# EAGLE design ETAG_v10.3_NOSDTRANS (EAGLE 9.6.2)

## Sheet 1 of 2
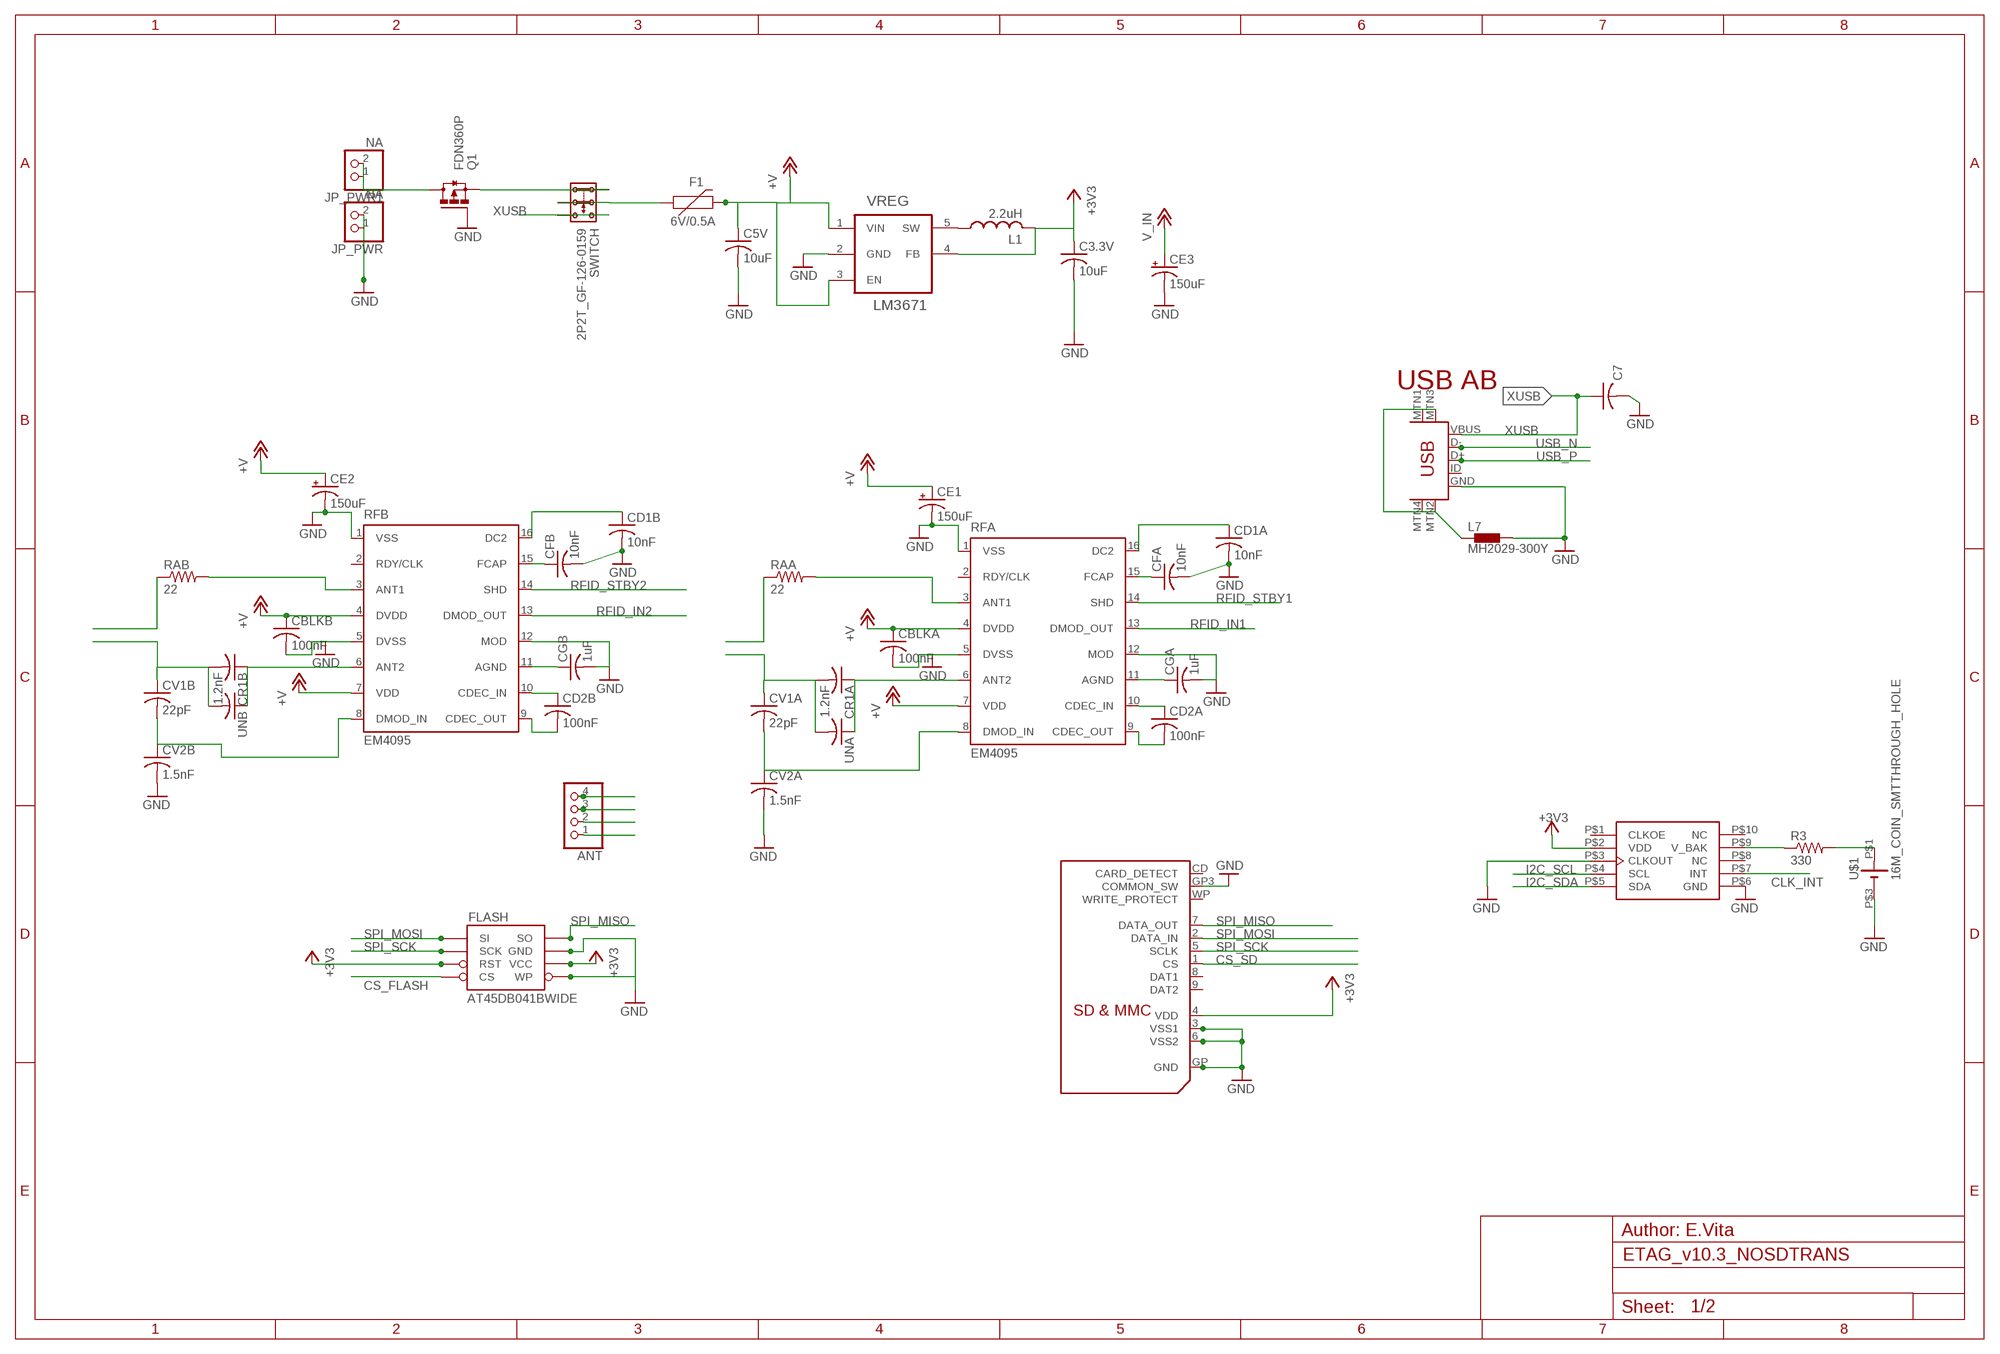
[diagram p0: schematic, sheet 1]

### Parts
ANT  PINHD-1X4  [1X04]
C3.3V  10uF  C-USC0805  [C0805]
C5V  10uF  C-USC0805  [C0805]
C7  10nF  C-USROUND  [C0603-ROUND]
CBLKA  100nF  C-US  [C0603-ROUND]
CBLKB  100nF  C-US  [C0603-ROUND]
CD1A  10nF  C-US  [C0603-ROUND]
CD1B  10nF  C-USROUND  [C0603-ROUND]
CD2A  100nF  C-US  [C0603-ROUND]
CD2B  100nF  C-US  [C0603-ROUND]
CE1  150uF  CPOL-USC  [PANASONIC_C]
CE2  150uF  CPOL-USC  [PANASONIC_C]
CE3  150uF  CPOL-USC  [PANASONIC_C]
CFA  10nF  C-USROUND  [C0603-ROUND]
CFB  10nF  C-US  [C0603-ROUND]
CGA  1uF  C-US  [C0603-ROUND]
CGB  1uF  C-US  [C0603-ROUND]
CR1A  1.2nF  C-USROUND  [C0603-ROUND]
CR1B  1.2nF  C-US  [C0603-ROUND]
CV1A  22pF  C-US  [C0603-ROUND]
CV1B  22pF  C-US  [C0603-ROUND]
CV2A  1.5nF  C-USROUND  [C0603-ROUND]
CV2B  1.5nF  C-US  [C0603-ROUND]
F1  6V/0.5A  PPTC_6V500MA-2  [1206]
FLASH  AT45DB041BWIDE  [SO08WIDE]
JP_PWR  NA  PINHD-1X2  [1X02]
JP_PWR1  NA  PINHD-1X2  [1X02]
L1  2.2uH  L-US4X4  [SMT_COIL_INDUCTOR_4X4MM]
L7  MH2029-300Y  BLM15H0805  [C0805K]
Q1  FDN360P  [SUPER-SOT3]
R3  330  R-US_ROUND  [C0603-ROUND]
RAA  22  R-US_R0805  [R0805]
RAB  22  R-US_R0805  [R0805]
RFA  EM4095  [SO16]
RFB  EM4095  [SO16]
RTC  MC-RTC-RV-3029-C3-I2C  [MC-RTC-C3_SPECIAL]
SD  SDMMC06132  [06132]
SWITCH  2P2T_GF-126-0159  [2P2T_GF-126-0159]
U$1  16M_COIN_SMTTHROUGH_HOLE  [16_MM_THROUGH_HOLE]
UNA  C-US  [C0603-ROUND]
UNB  C-US  [C0603-ROUND]
USB  USB-MINIB-5PIN  [USB-MINIB]
VREG  LM3671  LM3671_SWITCHING_REGSOT23  [SOT23-5L]

### Nets
2GND [gnd]: L7.1 USB.MTN1(MTN2) USB.MTN2(MTN3) USB.MTN3(MTN1) USB.MTN4
12_IN: JP_PWR1.1 JP_PWR1.2 Q1.3(D)
+3V3: C3.3V.1 FLASH.3(RST) FLASH.6(VCC) L1.P$2 RTC.P$2(VDD) SD.4(VDD) VREG.4(FB) ; also sheet 2
AANT: ANT.4 RAA.1
BANT: ANT.2 RAB.1
CLK_INT: RTC.P$7(INT) ; also sheet 2
CS_FLASH: FLASH.4(CS) ; also sheet 2
CS_SD: SD.1(CS) ; also sheet 2
CVA: ANT.3 CR1A.2 CV1A.1 UNA.2
CVB: ANT.1 CR1B.2 CV1B.1 UNB.2
GND [gnd]: C3.3V.2 C5V.2 C7.2 CBLKA.2 CBLKB.2 CD1A.2 CD1B.2 CE1.- CE2.- CE3.- CFA.2 CFB.2 CGA.2 CGB.2 CV2A.2 CV2B.2 FLASH.5(WP) FLASH.7(GND) JP_PWR.1 JP_PWR.2 L7.2 Q1.1(G) RFA.1(VSS) RFA.5(DVSS) RFA.12(MOD) RFB.1(VSS) RFB.5(DVSS) RFB.12(MOD) RTC.P$3(CLKOUT) RTC.P$6(GND) SD.3(VSS1) SD.6(VSS2) SD.GP3(COMMON_SW) SD.GP(GND) U$1.P$3(-) USB.GND VREG.2(GND) ; also sheet 2
I2C_SCL: RTC.P$4(SCL) ; also sheet 2
I2C_SDA: RTC.P$5(SDA) ; also sheet 2
N$2: CFB.1 RFB.15(FCAP)
N$3: CGB.1 RFB.11(AGND)
N$4: CFA.1 RFA.15(FCAP)
N$5: CGA.1 RFA.11(AGND)
N$6: CD1A.1 RFA.16(DC2)
N$7: CR1B.1 RFB.6(ANT2) UNB.1
N$8: CV1B.2 CV2B.1 RFB.8(DMOD_IN)
N$9: CD1B.1 RFB.16(DC2)
N$10: F1.1 SWITCH.P2A(2.1) SWITCH.P2B(2.2)
N$11: CD2B.2 RFB.9(CDEC_OUT)
N$12: CR1A.1 RFA.6(ANT2) UNA.1
N$13: CV1A.2 CV2A.1 RFA.8(DMOD_IN)
N$15: CD2B.1 RFB.10(CDEC_IN)
N$16: RAB.2 RFB.3(ANT1)
N$17: Q1.2(S) SWITCH.P1A(1.1) SWITCH.P1B(1.2)
N$18: CD2A.2 RFA.9(CDEC_OUT)
N$19: CD2A.1 RFA.10(CDEC_IN)
N$20: RAA.2 RFA.3(ANT1)
N$21: R3.1 RTC.P$9(V_BAK)
N$23: R3.2 U$1.P$1(+)
RFID_IN1: RFA.13(DMOD_OUT) ; also sheet 2
RFID_IN2: RFB.13(DMOD_OUT) ; also sheet 2
RFID_STBY1: RFA.14(SHD) ; also sheet 2
RFID_STBY2: RFB.14(SHD) ; also sheet 2
SPI_MISO: FLASH.8(SO) SD.7(DATA_OUT) ; also sheet 2
SPI_MOSI: FLASH.1(SI) SD.2(DATA_IN) ; also sheet 2
SPI_SCK: FLASH.2(SCK) SD.5(SCLK) ; also sheet 2
SW: L1.P$1 VREG.5(SW)
USB_N: USB.D- ; also sheet 2
USB_P: USB.D+ ; also sheet 2
V_IN: C5V.1 CBLKA.1 CBLKB.1 CE1.+ CE2.+ CE3.+ F1.2 RFA.4(DVDD) RFA.7(VDD) RFB.4(DVDD) RFB.7(VDD) VREG.1(VIN) VREG.3(EN) ; supply symbol labelled +V ; also sheet 2
XUSB [usbvcc]: C7.1 SWITCH.P3A(3.1) SWITCH.P3B(3.2) USB.VBUS
Unconnected: RFA.2(RDY/CLK) RFB.2(RDY/CLK) RTC.P$1(CLKOE) RTC.P$8(NC) RTC.P$10(NC) SD.8(DAT1) SD.9(DAT2) SD.CD(CARD_DETECT) SD.WP(WRITE_PROTECT) USB.ID

### Notes on the sheet
- USB AB
- Author: E.Vita

## Sheet 2 of 2
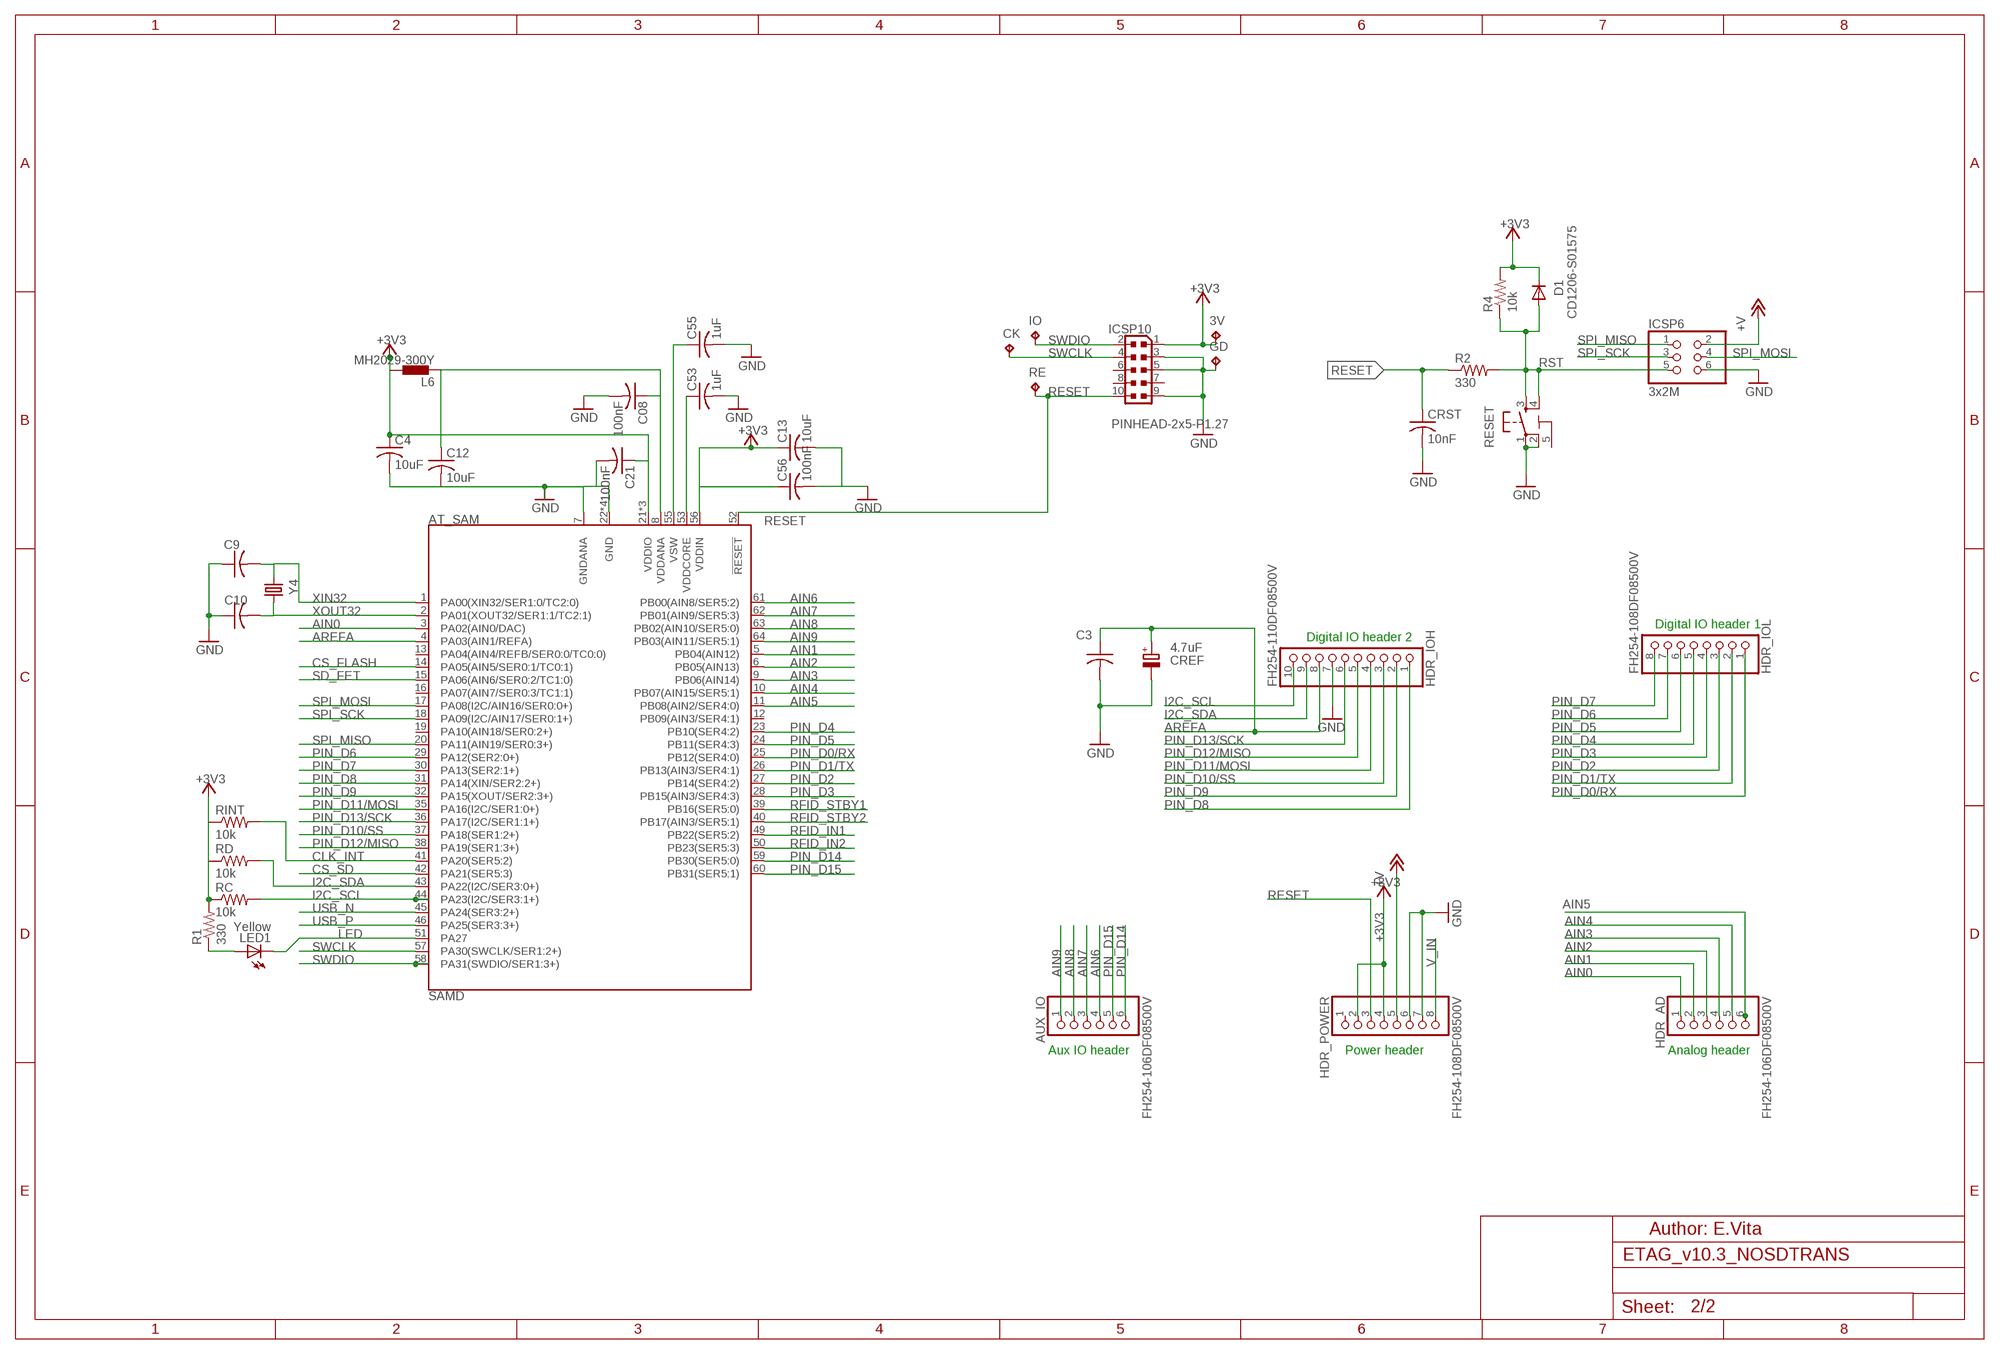
[diagram p1: schematic, sheet 2]

### Parts
3V  TPTP12R  [TP12R]
AT_SAM  SAMD  ATSAML21JTQFP_10MM_0.5PITCH  [TQFP_10MM_0.5PITCH]
AUX_IO  FH254-106DF08500V  1682_20TW-535_STD  [1X06]
C3  100nF  C-USROUND  [C0603-ROUND]
C4  10uF  C-USC0805  [C0805]
C08  100nF  C-USROUND  [C0603-ROUND]
C9  22pF  C-USROUND  [C0603-ROUND]
C10  22pF  C-USROUND  [C0603-ROUND]
C12  10uF  C-USC0805  [C0805]
C13  10uF  C-USC0805  [C0805]
C21  100nF  C-USROUND  [C0603-ROUND]
C53  1uF  C-USROUND  [C0603-ROUND]
C55  1uF  C-USROUND  [C0603-ROUND]
C56  100nF  C-USROUND  [C0603-ROUND]
CK  TPTP12R  [TP12R]
CREF  4.7uF  0474_TAJA475M016RNJ  [SMC_A]
CRST  10nF  C-USROUND  [C0603-ROUND]
D1  CD1206-S01575  0012_CD1206-S01575  [MINIMELF]
GD  TPTP12R  [TP12R]
HDR_AD  FH254-106DF08500V  1682_20TW-535_STD  [1X06]
HDR_IOH  FH254-110DF08500V  1684_20TW-537  [1X10]
HDR_IOL  FH254-108DF08500V  1683_20TW-536  [1X08]
HDR_POWER  FH254-108DF08500V  1683_20TW-536  [1X08]
ICSP6  3x2M  0114_PH254-203DF118A00V  [2X03]
ICSP10  PINHEAD-2x5-P1.27  0171_PH127-205DF055G00AROUND-PADS  [PINHEAD_2X05_127]
IO  TPTP12R  [TP12R]
L6  MH2029-300Y  BLM15H0805  [C0805K]
LED1  Yellow  0044_KPT-2012YC  [CHIPLED_0805]
R1  330  R-US_ROUND  [C0603-ROUND]
R2  330  R-US_ROUND  [C0603-ROUND]
R4  10k  R-US_ROUND  [C0603-ROUND]
RC  10k  R-US_ROUND  [C0603-ROUND]
RD  10k  R-US_ROUND  [C0603-ROUND]
RE  TPTP12R  [TP12R]
RESET  TS42031-160R-TR-7260  0946_TS42031-160W-TR-7260  [TS42]
RINT  10k  R-US_ROUND  [C0603-ROUND]
Y4  32,768Khz  0213_ABS07-32.768KHZ-T  [RESONATOR_EPSON_FC_145]

### Nets
+3V3: 3V.TP AT_SAM.21(VDDIO) AT_SAM.34(VDDIO) AT_SAM.48(VDDIO) AT_SAM.56(VDDIN) C4.1 C13.1 C21.1 C56.1 D1.C HDR_POWER.2 HDR_POWER.4 ICSP10.1 L6.2 R1.2 R4.2 RC.1 RD.1 RINT.1 ; also sheet 1
AIN0: AT_SAM.3(PA02(AIN0/DAC)) HDR_AD.1
AIN1: AT_SAM.5(PB04(AIN12)) HDR_AD.2
AIN2: AT_SAM.6(PB05(AIN13)) HDR_AD.3
AIN3: AT_SAM.9(PB06(AIN14)) HDR_AD.4
AIN4: AT_SAM.10(PB07(AIN15/SER5:1)) HDR_AD.5
AIN5: AT_SAM.11(PB08(AIN2/SER4:0)) HDR_AD.6
AIN6: AT_SAM.61(PB00(AIN8/SER5:2)) AUX_IO.4
AIN7: AT_SAM.62(PB01(AIN9/SER5:3)) AUX_IO.3
AIN8: AT_SAM.63(PB02(AIN10/SER5:0)) AUX_IO.2
AIN9: AT_SAM.64(PB03(AIN11/SER5:1)) AUX_IO.1
AREFA: AT_SAM.4(PA03(AIN1/REFA)) C3.1 CREF.+ HDR_IOH.8
CLK_INT: AT_SAM.41(PA20(SER5:2)) RINT.2 ; also sheet 1
CS_FLASH: AT_SAM.14(PA05(AIN5/SER0:1/TC0:1)) ; also sheet 1
CS_SD: AT_SAM.42(PA21(SER5:3)) ; also sheet 1
GND [gnd]: AT_SAM.7(GNDANA) AT_SAM.22(GND) AT_SAM.33(GND) AT_SAM.47(GND) AT_SAM.54(GND) C3.2 C4.2 C08.2 C9.1 C10.1 C12.2 C13.2 C21.2 C53.2 C55.2 C56.2 CREF.- CRST.2 GD.TP HDR_IOH.7 HDR_POWER.6 HDR_POWER.7 ICSP6.6 ICSP10.3 ICSP10.5 ICSP10.9 RESET.1 RESET.2 ; also sheet 1
I2C_SCL: AT_SAM.44(PA23(I2C/SER3:1+)) HDR_IOH.10 RC.2 ; also sheet 1
I2C_SDA: AT_SAM.43(PA22(I2C/SER3:0+)) HDR_IOH.9 RD.2 ; also sheet 1
LED: AT_SAM.51(PA27) LED1.C
N$1: LED1.A R1.1
N$24: AT_SAM.53(VDDCORE) C53.1
N$25: AT_SAM.55(VSW) C55.1
PIN_D0/RX: AT_SAM.25(PB12(SER4:0)) HDR_IOL.1
PIN_D1/TX: AT_SAM.26(PB13(AIN3/SER4:1)) HDR_IOL.2
PIN_D2: AT_SAM.27(PB14(SER4:2)) HDR_IOL.3
PIN_D3: AT_SAM.28(PB15(AIN3/SER4:3)) HDR_IOL.4
PIN_D4: AT_SAM.23(PB10(SER4:2)) HDR_IOL.5
PIN_D5: AT_SAM.24(PB11(SER4:3)) HDR_IOL.6
PIN_D6: AT_SAM.29(PA12(SER2:0+)) HDR_IOL.7
PIN_D7: AT_SAM.30(PA13(SER2:1+)) HDR_IOL.8
PIN_D8: AT_SAM.31(PA14(XIN/SER2:2+)) HDR_IOH.1
PIN_D9: AT_SAM.32(PA15(XOUT/SER2:3+)) HDR_IOH.2
PIN_D10/SS: AT_SAM.37(PA18(SER1:2+)) HDR_IOH.3
PIN_D11/MOSI: AT_SAM.35(PA16(I2C/SER1:0+)) HDR_IOH.4
PIN_D12/MISO: AT_SAM.38(PA19(SER1:3+)) HDR_IOH.5
PIN_D13/SCK: AT_SAM.36(PA17(I2C/SER1:1+)) HDR_IOH.6
PIN_D14: AT_SAM.59(PB30(SER5:0)) AUX_IO.6
PIN_D15: AT_SAM.60(PB31(SER5:1)) AUX_IO.5
RESET: AT_SAM.52(!RESET!) CRST.1 HDR_POWER.3 ICSP10.10 R2.1 RE.TP
RFID_IN1: AT_SAM.49(PB22(SER5:2)) ; also sheet 1
RFID_IN2: AT_SAM.50(PB23(SER5:3)) ; also sheet 1
RFID_STBY1: AT_SAM.39(PB16(SER5:0)) ; also sheet 1
RFID_STBY2: AT_SAM.40(PB17(AIN3/SER5:1)) ; also sheet 1
RST: D1.A ICSP6.5 R2.2 R4.1 RESET.3 RESET.4
SD_FET: AT_SAM.15(PA06(AIN6/SER0:2/TC1:0))
SPI_MISO: AT_SAM.20(PA11(AIN19/SER0:3+)) ICSP6.1 ; also sheet 1
SPI_MOSI: AT_SAM.17(PA08(I2C/AIN16/SER0:0+)) ICSP6.4 ; also sheet 1
SPI_SCK: AT_SAM.18(PA09(I2C/AIN17/SER0:1+)) ICSP6.3 ; also sheet 1
SWCLK: AT_SAM.57(PA30(SWCLK/SER1:2+)) CK.TP ICSP10.4
SWDIO: AT_SAM.58(PA31(SWDIO/SER1:3+)) ICSP10.2 IO.TP
USB_N: AT_SAM.45(PA24(SER3:2+)) ; also sheet 1
USB_P: AT_SAM.46(PA25(SER3:3+)) ; also sheet 1
V_IN: HDR_POWER.5 HDR_POWER.8 ICSP6.2 ; supply symbol labelled +V ; also sheet 1
VDDANA: AT_SAM.8(VDDANA) C08.1 C12.1 L6.1
XIN32: AT_SAM.1(PA00(XIN32/SER1:0/TC2:0)) C9.2 Y4.P$1
XOUT32: AT_SAM.2(PA01(XOUT32/SER1:1/TC2:1)) C10.2 Y4.P$2
Unconnected: AT_SAM.12(PB09(AIN3/SER4:1)) AT_SAM.13(PA04(AIN4/REFB/SER0:0/TC0:0)) AT_SAM.16(PA07(AIN7/SER0:3/TC1:1)) AT_SAM.19(PA10(AIN18/SER0:2+)) HDR_POWER.1 ICSP10.6 ICSP10.7 ICSP10.8

### Notes on the sheet
- Digital IO header 1
- Digital IO header 2
- Aux IO header | Power header | Analog header
- Author: E.Vita

## Power pins joined to a net without a drawn wire
5-GND: RESET.5(5-GND)

## Library data of the parts
3V CK GD IO RE = testpad:TP: Test pad
ANT = pinhead:PINHD-1X4: PIN HEADER
AT_SAM = greg-MCU:ATSAML21J: Atmel SAML21J ARM Cortex-M0+ Microcontroller The Atmel ® | SMART ™ SAM L21 is a series of low-power microcontrollers using the 32-bit ARM ® Cortex ® -M0+ processor, and ranging from 32- to 64-pins with up to 256KB Flash and 32KB of SRAM. The SAM L21 devices operate at a maximum frequency of 48MHz and reach 2.46 CoreMark/MHz. They are designed for simple and intuitive migration with identical peripheral modules, hex compatible code, identical linear address map and pin compatible migration paths between all devices in the product series. All devices include intelligent and flexible peripherals, Atmel Event System for inter-peripheral signaling, and support for capacitive touch button, slider and wheel user interfaces.
AUX_IO HDR_AD = Connettori:1682_20TW-535: Female Gray Connector strip for Arduino 3V3 bases - 6x1 F V h 8,5 p2,54; MONTHLY_USAGE: 86722.85; PART_NUMBER: 20TW-535; PRICE: _0.03; SUPPLIER: CBC_elettronica__s.r.l.; TYPE: Connettori
C3 C3.3V C4 C5V C7 C08 C9 C10 C12 C13 C21 C53 C55 C56 CBLKA CBLKB CD1A CD1B CD2A CD2B CFA CFB CGA CGB CR1A CR1B CRST CV1A CV1B CV2A CV2B UNA UNB = rcl:C-US: CAPACITOR, American symbol
CE1-CE3 = rcl:CPOL-US: POLARIZED CAPACITOR, American symbol
CREF = Condensatori:0474_TAJA475M016RNJ: 4u7 tantalio Case A - testa gialla -Tantalio; CASE: CaseA_(1206); MONTHLY_USAGE: _____; PART_NUMBER: TAJA475M016RNJ; PRICE: _____; SUPPLIER: _____; TYPE: Condensatori; VALUE: 4u7
D1 = Diodi:0012_CD1206-S01575: small-signal high-speed Switching Diodes CD1206; CASE: 1206; MONTHLY_USAGE: _____; PART_NUMBER: CD1206-S01575; PRICE: _____; SUPPLIER: _____; TYPE: Diodi
F1 = SparkFun-Fuses:PPTC: Resettable Fuse PPTC Resettable Fuse. Really a sort of resistor with a polymeric positive temperature coefficient whose resistance increases dramatically with an increase in temperature. When heated by the power passing through the resistance rises causing the current to be limited, protecting the circuit. This is achieved by the transition of the polymer from a crystalline to an amorphous state where the conductive carbon separates breaking the conductive pathways found in the cool crystalline structure. When a PPTC cools back down it resumes conducting letting the circuit turn back on. SparkFun Products: SparkFun RedBoard - Programmed with Arduino <https://www.sparkfun.com/products/12757> Pro Micro - 5V/16MHz <https://www.sparkfun.com/products/12640> Arduino Pro 328 - 5V/16MHz <https://www.sparkfun.com/products/10915> MP3 Trigger <https://www.sparkfun.com/products/13720>; PROD_ID: RES-08585
FLASH = SparkFun-DigitalIC:AT45DB041B: 4-Mbit SPI flash memory
HDR_IOH = Connettori:1684_20TW-537: Female Gray Connector strip for Arduino 3V3 bases - 10x1 F V h 8,5 p2,54mm; MONTHLY_USAGE: _____; PART_NUMBER: 20TW-537; PRICE: _____; SUPPLIER: _____; TYPE: Connettori
HDR_IOL HDR_POWER = Connettori:1683_20TW-536: Female Gray Connector strip for Arduino 3V3 bases - 8x1 F V h 8,5 p2,54mm; MONTHLY_USAGE: _____; PART_NUMBER: 20TW-536; PRICE: _____; SUPPLIER: _____; TYPE: Connettori
ICSP6 = Connettori:0114_PH254-203DF118A00V: 3x2 M V h 8,5 mm p2,54; MONTHLY_USAGE: _____; PART_NUMBER: PH254-203DF118A00V; PRICE: _____; SUPPLIER: _____; TYPE: Connettori; VALUE: ICSP
ICSP10 = Connettori:0171_PH127-205DF055G00A: 2x5 PASSO 1,27
JP_PWR JP_PWR1 = pinhead:PINHD-1X2: PIN HEADER
L1 = rcl:L-US: INDUCTOR, American symbol
L6 L7 = inductors:BLM15H: EMIFIL (R) Chip Ferrite Bead for GHz Noise Source: http://www.murata.com/ Ferrite Bead BLM15H.pdf
LED1 = Opto:0044_KPT-2012YC: LED YELLOW - SMD - 0805; MONTHLY_USAGE: _____; PART_NUMBER: KPT-2012YC; PRICE: _____; SUPPLIER: _____; TYPE: Opto
Q1 = transistor-power:FDN360P: Single P-Channel, PowerTrench (R) MOSFET Source: http://www.fairchildsemi.com/ds/FD/FDN360P.pdf
R1-R4 RAA RAB RC RD RINT = rcl:R-US_: RESISTOR, American symbol
RESET = Switches:0946_TS42031-160W-TR-7260: Pushbutton 6x6 Smd - White; MONTHLY_USAGE: _____; PART_NUMBER: IT-1157AHNP-160G-G_GTR; PRICE: _____; SUPPLIER: _____; TYPE: Switches; VALUE: TS42
RFA RFB = em-microelectronic:EM4095: Read/Write analog front end for 125kHz RFID Basestation Source: http://www.emmicroelectronic.com/webfiles/Product/RFID/DS/EM4095_DS.pdf
RTC = Microcrystal-RTC:MC-RTC-RV-3029-C3-I2C: Microcrystal RV-3029-C3 Real Time Clock Module with I2C-Bus Extremely Accurate RTC Module with embedded Xtal. I2C Interface Temperature Compensation Automotive qualified, according to AEC-Q200 Rev. C Option A: Calibrated Temperature Time Deviation @ +25°C ± 0.26 s/day ± 3ppm 0°C to +50°C ± 0.35 s/day ± 4ppm -10°C to +60°C ± 0.44 s/day ± 5ppm -40°C to +85°C ± 0.52 s/day ± 6ppm -40°C to +125°C ± 0.70 s/day ± 8ppm Option B: Default Temperature Time Deviation @ +25°C ± 0.26 s/day ± 3ppm 0°C to +50°C ± 0.44 s/day ± 5ppm -10°C to +60°C ± 0.87 s/day ±10ppm -40°C to +85°C ± 2.17 s/day ±25ppm -40°C to +125°C ± 2.60 s/day ±30ppm
SD = microbuilder:SDMMC: SD MMC Card holder 4UCON part #06132 - easy to solder
SWITCH = switch:2P2T_GF-126-0159
U$1 = battery:16M_COIN_SMT
USB = USB_miniB:USB-MINIB
VREG = Texas Instruments:LM3671_SWITCHING_REG
Y4 = Cristalli:0213_ABS07-32.768KHZ-T: 32,768KHz - SMD; MONTHLY_USAGE: _____; PART_NUMBER: ABS07-32.768KHZ-T; PRICE: _____; SUPPLIER: _____; TYPE: Cristalli; VALUE: 32,768Khz_SMD

## Net classes
1 USB: width 0.203 mm, drill 0.305 mm, clearance 0.178 mm
2 gnd: width 0.254 mm, drill 0.254 mm, clearance 0.178 mm
3 usbvcc: width 0.203 mm, drill 0.406 mm, clearance 0.178 mm
4 USBpair: width 0.254 mm, drill 0.406 mm, clearance 0.406 mm

## Board
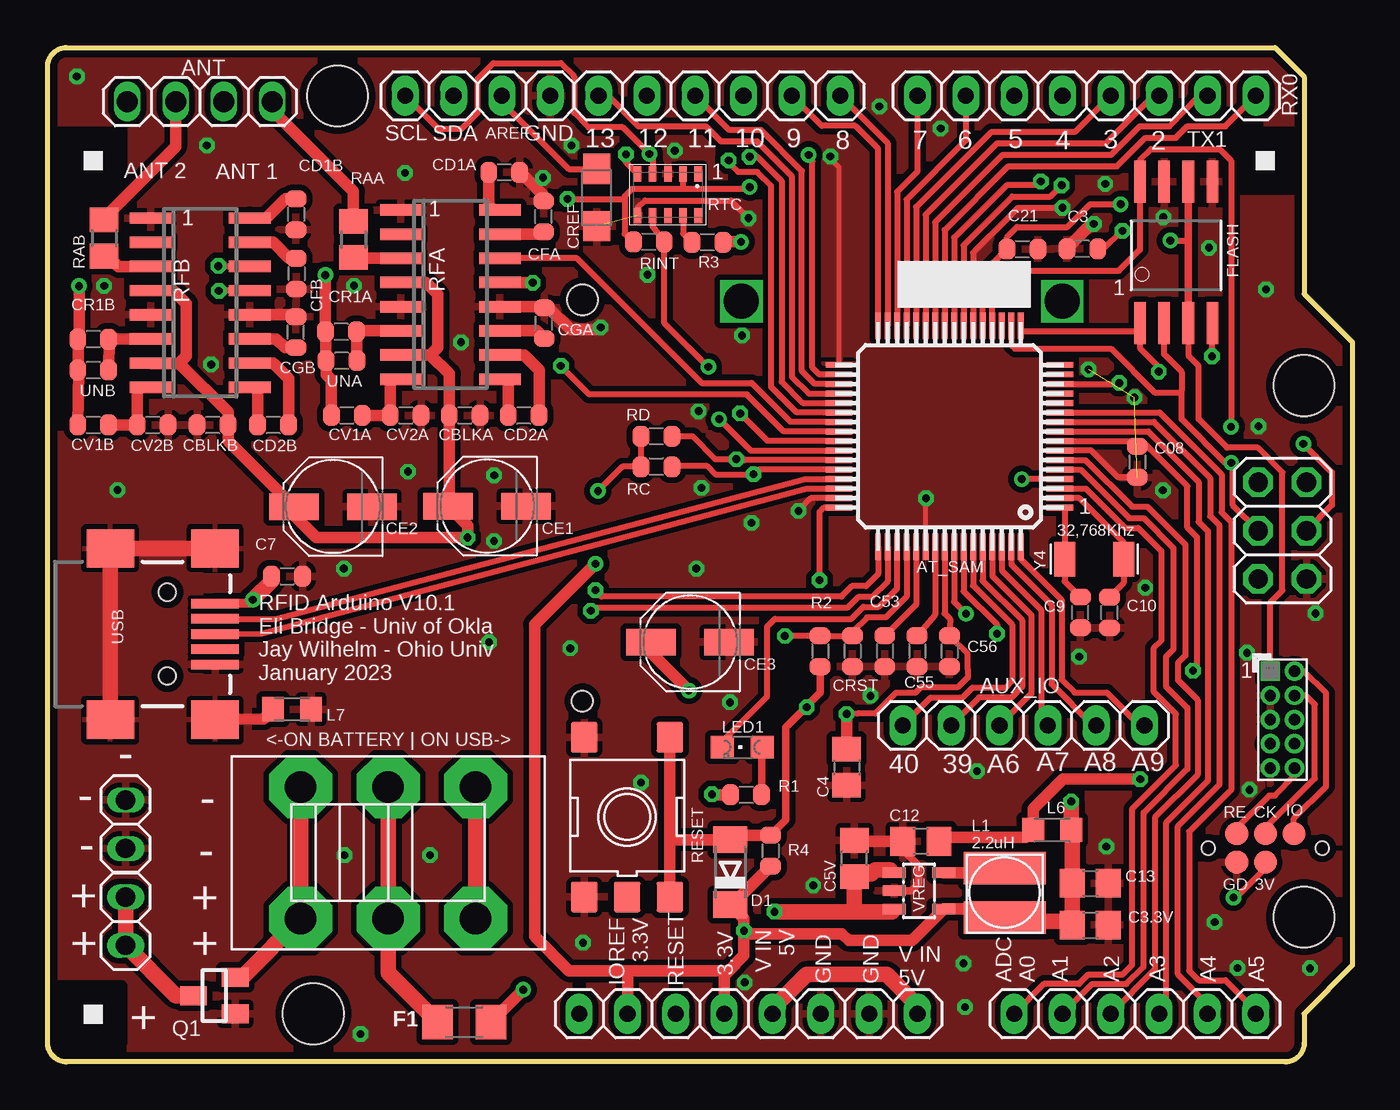
[diagram p2: board, top side]
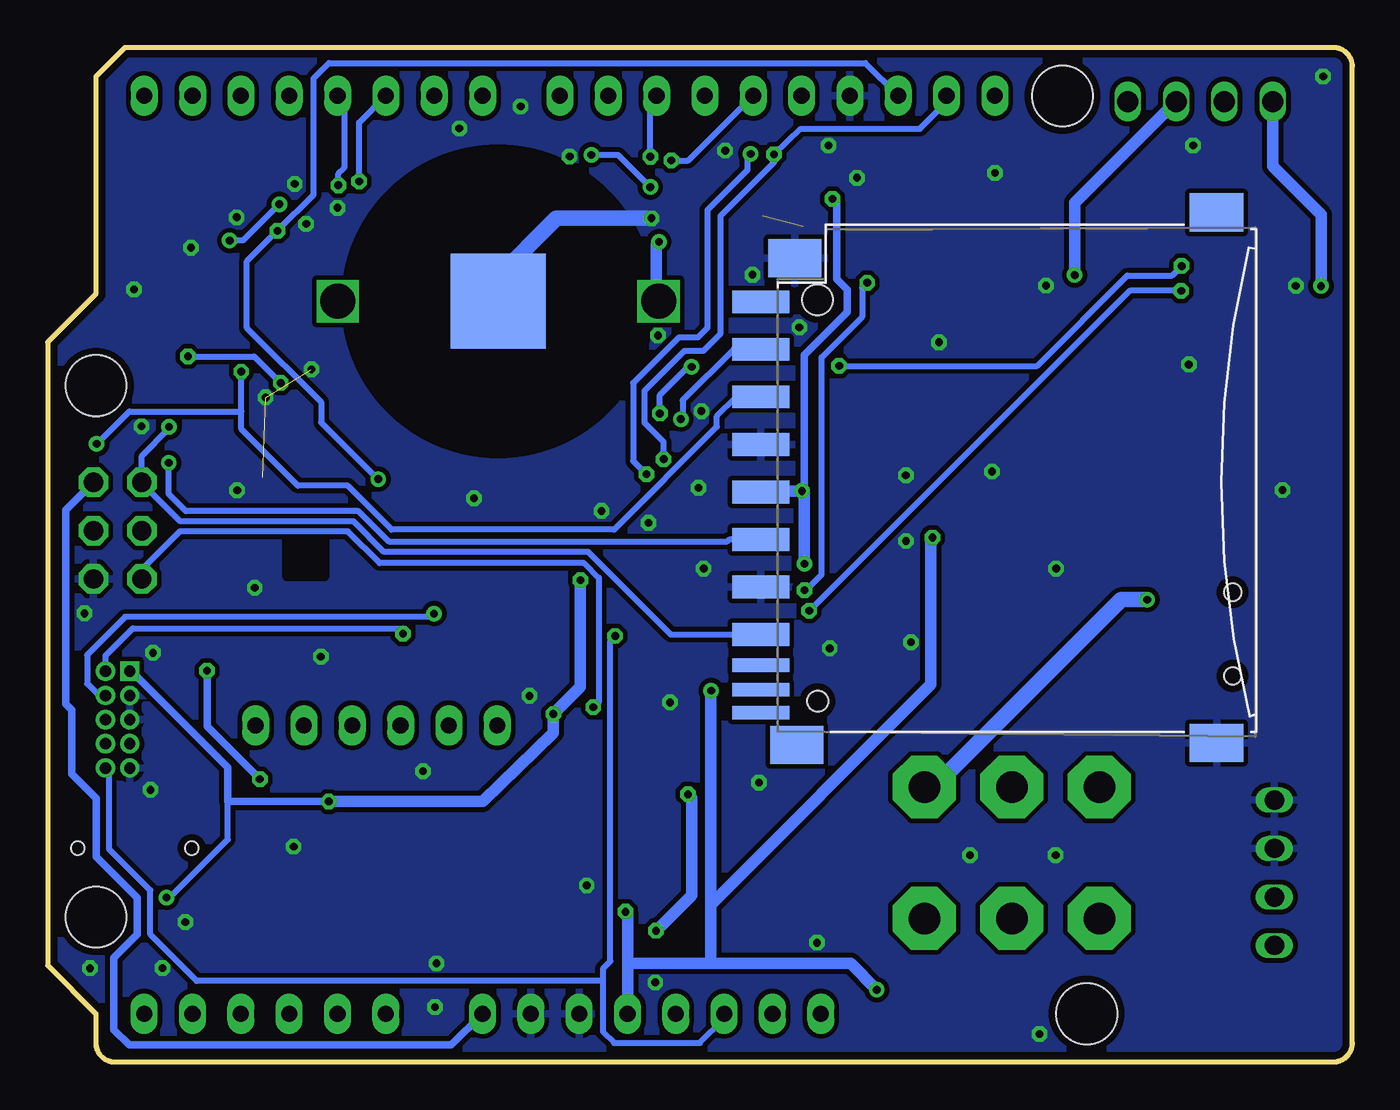
[diagram p3: board, bottom side, seen from below]

Size 68.58 x 53.34 mm. Coordinates in mm from the lower left corner, seen from the top.
Outline: 64.52,53.34 66.04,51.82 66.04,40.39 68.58,37.85 68.58,5.08 66.04,2.54 66.04,1 arc-90 65.04,0 1,0 arc-90 0,1 0,52.34 arc-90 1,53.34 64.52,53.34
Copper layers (1*2+15*16): Top 0.035mm / dielectric 0.5mm / layer 2 0.035mm / dielectric 0.4mm / layer 15 0.035mm / dielectric 0.5mm / Bottom 0.035mm
Design rules "ArduinoUno *": minimum track width 6mil, minimum drill 16mil, track to track 6mil, track to pad 6mil, pad to pad 4mil, via to via 6mil, smd to smd 4mil, copper to edge 15mil, drill to drill 10mil, minimum pad ring 6mil, minimum via ring 4.5mil, stop-mask expansion 1mil, vias tented up to drill 32mil, thermal gap 10mil
Holes 3.2 mm at 66.04,35.56 66.04,7.62 15.24,50.8 13.97,2.54
Holes 0.7 mm at 61,11.25 67,11.25
bRestrict: area 36.9,32 to 52.9,48

### Footprints (pad centres in the part's own frame; a part is rotated, then mirrored left to right if it is on the bottom)
TP12R = smd 1.2 x 1.2: TP 0,0
1X04 = drill 1.1 long: 1 -3.81,0; 2 -1.27,0; 3 1.27,0; 4 3.81,0
TQFP_10MM_0.5PITCH = smd 1.4 x 0.3: 1 -5.8,3.75; 2 -5.8,3.25; 3 -5.8,2.75; 4 -5.8,2.25; 5 -5.8,1.75; 6 -5.8,1.25; 7 -5.8,0.75; 8 -5.8,0.25; 9 -5.8,-0.25; 10 -5.8,-0.75; 11 -5.8,-1.25; 12 -5.8,-1.75; 13 -5.8,-2.25; 14 -5.8,-2.75; 15 -5.8,-3.25; 16 -5.8,-3.75; 33 5.8,-3.75; 34 5.8,-3.25; 35 5.8,-2.75; 36 5.8,-2.25; 37 5.8,-1.75; 38 5.8,-1.25; 39 5.8,-0.75; 40 5.8,-0.25; 41 5.8,0.25; 42 5.8,0.75; 43 5.8,1.25; 44 5.8,1.75; 45 5.8,2.25; 46 5.8,2.75; 47 5.8,3.25; 48 5.8,3.75 | smd 0.3 x 1.4: 17 -3.75,-5.8; 18 -3.25,-5.8; 19 -2.75,-5.8; 20 -2.25,-5.8; 21 -1.75,-5.8; 22 -1.25,-5.8; 23 -0.75,-5.8; 24 -0.25,-5.8; 25 0.25,-5.8; 26 0.75,-5.8; 27 1.25,-5.8; 28 1.75,-5.8; 29 2.25,-5.8; 30 2.75,-5.8; 31 3.25,-5.8; 32 3.75,-5.8; 49 3.75,5.8; 50 3.25,5.8; 51 2.75,5.8; 52 2.25,5.8; 53 1.75,5.8; 54 1.25,5.8; 55 0.75,5.8; 56 0.25,5.8; 57 -0.25,5.8; 58 -0.75,5.8; 59 -1.25,5.8; 60 -1.75,5.8; 61 -2.25,5.8; 62 -2.75,5.8; 63 -3.25,5.8; 64 -3.75,5.8
1X06 = drill 0.85 pad 1.422 long: 1 -6.35,0; 2 -3.81,0; 3 -1.27,0; 4 1.27,0; 5 3.81,0; 6 6.35,0
C0603-ROUND = smd 0.898 x 1.1: 1 -0.813,0; 2 0.813,0
C0805 = smd 1.3 x 1.5: 1 -0.95,0; 2 0.95,0
PANASONIC_C = smd 2.6 x 1.4: + 2.05,0; - -2.05,0
SMC_A = smd 1.6 x 1.4: + -1.5,0; - 1.5,0
MINIMELF = smd 1.4 x 1.8: A 1.7,0; C -1.7,0
1206 = smd 1.6 x 1.8: 1 -1.4,0; 2 1.4,0
SO08WIDE = smd 0.61 x 2.21: 1 -1.905,-3.569; 2 -0.635,-3.569; 3 0.635,-3.569; 4 1.905,-3.569; 5 1.905,3.886; 6 0.635,3.886; 7 -0.635,3.886; 8 -1.905,3.886
1X10 = drill 0.85 pad 1.422 long: 1 -11.43,0; 2 -8.89,0; 3 -6.35,0; 4 -3.81,0; 5 -1.27,0; 6 1.27,0; 7 3.81,0; 8 6.35,0; 9 8.89,0; 10 11.43,0
1X08 = drill 0.85 pad 1.422 long: 1 -8.89,0; 2 -6.35,0; 3 -3.81,0; 4 -1.27,0; 5 1.27,0; 6 3.81,0; 7 6.35,0; 8 8.89,0
2X03 = drill 1.016 pad 1.55 octagon: 1 -2.54,-1.27; 2 -2.54,1.27; 3 0,-1.27; 4 0,1.27; 5 2.54,-1.27; 6 2.54,1.27
PINHEAD_2X05_127 = drill 0.6 pad 1.016 square: 1 -0.635,2.54 | drill 0.6 pad 1.016: 2 0.635,2.54; 3 -0.635,1.27; 4 0.635,1.27; 5 -0.635,0; 6 0.635,0; 7 -0.635,-1.27; 8 0.635,-1.27; 9 -0.635,-2.54; 10 0.635,-2.54
1X02 = drill 1.016 long: 1 -1.27,0; 2 1.27,0
SMT_COIL_INDUCTOR_4X4MM = smd 1.7 x 4.3: P$1 -1.3,0; P$2 1.3,0
C0805K = smd 1.143 x 1.27: 1 -1,0; 2 1,0
CHIPLED_0805 = smd 1.2 x 1.2: A 0,-1.05; C 0,1.05
SUPER-SOT3 = smd 1 x 1.4: 1 -0.95,-1.1; 2 0.95,-1.1; 3 0,1.1
R0805 = smd 1.3 x 1.5: 1 -0.95,0; 2 0.95,0
TS42 = smd 1.6 x 1.4: 1 -4.2,2.25; 2 4.2,2.25; 3 -4.2,-2.25; 4 4.2,-2.25; 5 -4.2,0
SO16 = smd 0.6 x 2.2: 1 -4.445,-2.6; 2 -3.175,-2.6; 3 -1.905,-2.6; 4 -0.635,-2.6; 5 0.635,-2.6; 6 1.905,-2.6; 7 3.175,-2.6; 8 4.445,-2.6; 9 4.445,2.6; 10 3.175,2.6; 11 1.905,2.6; 12 0.635,2.6; 13 -0.635,2.6; 14 -1.905,2.6; 15 -3.175,2.6; 16 -4.445,2.6
MC-RTC-C3_SPECIAL = smd 0.4 x 0.8: P$1 -1.6,-1.1; P$2 -0.8,-1.1; P$3 0,-1.1; P$4 0.8,-1.1; P$5 1.6,-1.1; P$6 1.6,1.1; P$7 0.8,1.1; P$8 0,1.1; P$9 -0.8,1.1; P$10 -1.6,1.1
06132 = smd 1.2 x 3: 1 6.9,0.9; 2 4.4,0.9; 3 1.9,0.9; 4 -0.6,0.9; 5 -3.1,0.9; 6 -5.6,0.9; 7 -8.1,0.9; 9 9.4,0.9 | smd 0.7 x 3: 8 -9.7,0.9; CD -11,0.9; WP -12.2,0.9 | smd 2 x 2.8: GP -13.8,-23.07; GP2 14.1,-23.07; GP3 11.7,-0.9; GP4 -13.9,-1 | hole 1.1: -11.6,-2.1 | hole 1.6: 9.5,-2.1
2P2T_GF-126-0159 = drill 1.651 pad 3.302 octagon: P1A -4.597,3.454; P1B -4.597,-3.454; P2A 0,3.454; P2B 0,-3.454; P3A 4.597,3.454; P3B 4.597,-3.454
16_MM_THROUGH_HOLE = drill 1.85 pad 2.2 square: P$1 -8.435,0; P$2 8.435,0 | smd 5 x 5: P$3 0,0
USB-MINIB = smd 2.5 x 0.5: D+ 2.5,0; D- 2.5,0.8; GND 2.5,-1.6; ID 2.5,-0.8; VBUS 2.5,1.6 | smd 2.5 x 2: MTN1 -3,4.5; MTN2 2.5,4.5; MTN3 -3,-4.5; MTN4 2.5,-4.5 | hole 0.9: 0,2.2; 0,-2.2
SOT23-5L = smd 0.55 x 1.2: 1 -0.95,-1.3; 2 0,-1.3; 3 0.95,-1.3; 4 0.95,1.3; 5 -0.95,1.3
RESONATOR_EPSON_FC_145 = smd 1.1 x 1.8: P$1 -1.55,0; P$2 1.55,0

### Placement (x,y rotation side)
3V  64,10.5 90 top
ANT  8,50.5 0 top
AT_SAM  47.4,32.9 180 top
AUX_IO  51.3,17.7 180 top
C3  54.38,42.76 180 top
C3.3V  54.8,7.2 0 top
C4  42,15.5 270 top
C5V  42.4,10.7 90 top
C7  12.59,25.54 0 top
C08  57.27,31.55 270 top
C9  54.28,23.64 90 top
C10  55.82,23.63 90 top
C12  45.9,11.6 180 top
C13  54.8,9.4 0 top
C21  51.23,42.74 0 top
C53  44,21.6 270 top
C55  45.7,21.6 270 top
C56  47.4,21.6 270 top
CBLKA  21.93,34 0 top
CBLKB  8.68,33.5 180 top
CD1A  24,46.77 0 top
CD1B  13.05,44.58 270 top
CD2A  25.02,34 180 top
CD2B  11.85,33.5 180 top
CE1  23.1,29.23 180 top
CE2  15,29.2 180 top
CE3  33.77,22.07 180 top
CFA  26.07,44.45 90 top
CFB  13.07,41.45 270 top
CGA  26.1,38.85 90 top
CGB  13.05,38.38 90 top
CK  64,12 90 top
CR1A  15.43,38.4 180 top
CR1B  2.4,38 180 top
CREF  28.86,45.45 270 top
CRST  42.3,21.6 270 top
CV1A  15.72,34 0 top
CV1B  2.4,33.5 0 top
CV2A  18.82,34 0 top
CV2B  5.53,33.5 0 top
D1  35.88,9.98 90 top
F1  21.9,2.1 0 top
FLASH  59.32,42.41 0 top
GD  62.5,10.5 90 top
HDR_AD  57.15,2.54 0 top
HDR_IOH  30.23,50.8 180 top
HDR_IOL  54.61,50.8 180 top
HDR_POWER  36.83,2.54 0 top
ICSP6  64.9,27.94 270 top
ICSP10  64.9,18 0 top
IO  65.5,12 90 top
JP_PWR  4.1,12.5 270 top
JP_PWR1  4.1,7.4 90 top
L1  50.3,8.9 270 top
L6  52.8,12.2 0 top
L7  12.85,18.55 0 top
LED1  36.51,16.55 90 top
Q1  8.76,3.49 90 top
R1  36.71,14.05 180 top
R2  40.6,21.6 270 top
R3  34.67,43.1 0 top
R4  37.99,11.11 270 top
RAA  16.07,43.25 270 top
RAB  2.98,43.33 270 top
RC  32,31.3 0 top
RD  32,32.9 0 top
RE  62.5,12 90 top
RESET  30.46,12.88 90 top
RFA  21.18,40.35 270 top
RFB  8.03,39.92 270 top
RINT  31.6,43.12 0 top
RTC  32.6,45.6 180 top
SD  30.21,30.57 90 bottom
SWITCH  17.9,11 0 top
U$1  44.9,40 180 bottom
U$2  [SQUARE-1MM-3R]  2.4,47.4 0 top
U$3  [SQUARE-1MM-3R]  64,47.4 0 top
U$4  [SQUARE-1MM-3R]  2.4,2.5 0 top
UNA  15.45,36.88 180 top
UNB  2.4,36.38 180 top
USB  6.3,22.5 0 top
VREG  45.8,9 270 top
Y4  55.01,26.44 0 top

### Tracks (layer width: path | path; a pad name or v marks a point on that pad's centre or on a via)
2GND
  Top 0.61: L7.1 11.35,18.05 USB.MTN4
  Top 0.813: USB.MTN3 USB.MTN1 USB.MTN2
  pour Top: 1.96,28.18 10.6,28.18 10.6,25.86 8.05,25.86 8.05,19.89 10.6,19.89 10.6,16.97 1.96,16.97
12_IN
  Top 0.813: JP_PWR1.2 JP_PWR1.1 6.74,3.49 Q1.3
+3V3  (via drill 0.41)
  Top 0.305: ICSP10.1 64.26,24.16 64.9,24.8 64.9,31 63.6,32.3 62,32.3 60.5,33.8 60.5,36.6 59.95,37.15 FLASH.3 | 33.4,45.9 30.7,45.9 30.32,45.52 30.32,45.38 | 33.4,45.9 RTC.P$2 | RD.1 31.19,31.68 31.2,31.69 31.19,31.68 RC.1 30.2,31.3 v28.93,30.02 | AT_SAM.21 49.15,41.47 C21.1 50.42,43.37 50.95,43.9 53.6,43.9 54.8,45.1 v56.4,45.1 | 3V.TP 64,10.18 62.48,8.65 v62.33,8.65 | v40.58,25.32 40.58,28.93 40.8,29.15 AT_SAM.48 | RINT.1 30.75,43.12 30.32,43.55 30.32,45.38 | v59.01,43.19 59.84,43.19 59.95,43.3 | AT_SAM.34 40.55,36.15 40.2,36.5 40.2,47.35 40,47.55 v40,47.7 | v36.9,46 36.8,45.9 33.4,45.9 | AT_SAM.56 47.15,23.58 47.44,23.29 C56.1 48.35,21.46 48.37,20.63 48.37,20.21 47.88,19.73 45.92,19.73 45.63,19.43 44.6,19.43 43.5,18.32 42.58,18.32 v42,18.3 | v27.32,45.38 30.32,45.38
  Top 0.406: FLASH.6 59.95,43.3 FLASH.3
  Top 0.61: R4.2 35.98,8.28 D1.C 36.6,7.56 v36.6,6.9 | 50.5,7.4 L1.P$2 49.85,8.05 VREG.4 45.45,6.4 42.1,6.4 41.75,6.75 36.75,6.75 v36.6,6.9 | v42,18.3 C4.1 | v34.92,14.07 34.88,14.05 R1.2 | v28.8,26.2 25.6,23 25.6,6.6 27.4,4.8 30.5,4.8 | 30.5,4.8 35.8,4.8 | 35.8,4.8 36.6,5.6 v36.6,6.9 | HDR_POWER.2 30.48,4.78 30.5,4.8 | HDR_POWER.4 35.56,4.56 35.8,4.8
  Top 0.813: 50.5,7.4 53.65,7.4 C3.3V.1 C13.1 53.85,12.15 L6.2 v53.8,13.7
  Bottom 0.305: v62.33,8.65 62.15,8.65 59.1,11.7 59.1,13.7 59.1,13.8 | 29.85,30 29.82,30.02 | 31.08,30 SD.4 | v56.4,45.1 58.31,43.19 v59.01,43.19 | v40,47.7 38.6,47.7 v36.9,46
  Bottom 0.406: ICSP10.1 64.16,20.54 59.1,15.48 59.1,13.8 | v53.8,13.7 59.1,13.7 | v27.32,45.38 27.1,45.15 27.1,41.17 26.55,40.62 26.55,39.42 28.8,37.17 28.8,29.6
  Bottom 0.61: v40.58,25.32 40.58,19.73 v42,18.3 42,17.3 45.7,13.7 v53.8,13.7 | v36.6,6.9 34.73,8.78 34.73,13.88 v34.92,14.07 | 29.82,30.02 v28.93,30.02 28.8,29.9 28.8,29.6 v28.8,26.2 | 31.08,30 29.85,30
AANT
  Top 0.61: ANT.4 11.81,50.05 16.07,45.78 RAA.1
AIN0
  Top 0.305: HDR_AD.1 52.36,4.1 54.2,4.1 54.7,4.6 56.5,4.6 57,5.1 57,13.3 59.3,15.6 59.3,18.3 58.15,19.45 58.15,21.77 58.55,22.18 58.55,26.85 57.31,28.09 56.64,28.09 54.58,30.15 AT_SAM.3
AIN1
  Top 0.305: HDR_AD.2 54.9,4.1 56.7,4.1 57.6,5 57.6,13.1 59.9,15.4 59.9,18.62 58.77,19.75 58.77,21.3 59.17,21.7 59.17,27.02 57.6,28.6 56.85,28.6 54.3,31.15 AT_SAM.5
AIN2
  Top 0.305: AT_SAM.6 54.54,31.65 54.55,31.65 57,29.2 57.8,29.2 59.8,27.2 59.8,21.38 59.4,20.98 59.4,20.07 60.45,19.02 60.45,15.1 58.2,12.85 58.2,4.86 HDR_AD.3
AIN3
  Top 0.305: AT_SAM.9 57.85,33.15 60.5,30.5 60.5,28.4 61,27.9 61,14.8 58.8,12.6 58.8,2.92 HDR_AD.4
AIN4
  Top 0.305: AT_SAM.10 58.15,33.65 61.1,30.7 61.1,28.7 61.6,28.2 61.6,14.6 59.4,12.4 59.4,4.6 60.96,3.04 HDR_AD.5
AIN5
  Top 0.305: AT_SAM.11 58.45,34.15 61.7,30.9 61.7,28.9 62.2,28.4 62.2,14.3 60,12.1 60,4.8 60.5,4.3 61.9,4.3 63.5,2.7 HDR_AD.6
AIN6
  Top 0.305: AT_SAM.61 49.65,25.55 51.7,23.5 51.7,19.37 AUX_IO.4
AIN7
  Top 0.305: AT_SAM.62 50.15,25.85 52.23,23.77 52.23,18.07 52.57,17.73 AUX_IO.3
AIN8
  Top 0.305: AT_SAM.63 50.65,26.15 52.77,24.02 52.77,19.87 54.94,17.7 AUX_IO.2
AIN9
  Top 0.305: AT_SAM.64 51.15,26.45 53.3,24.3 53.3,20.1 53.97,19.43 55.66,19.43 57.38,17.7 AUX_IO.1
AREFA  (via drill 0.41)
  Top 0.305: v56.5,43.7 56.43,43.63 56.4,43.66 55.49,42.76 C3.1 | AT_SAM.4 v51.2,30.65 | HDR_IOH.8 23.88,50.48 27.4,46.95 CREF.+
  Bottom 0.305: v51.2,30.65 51.23,30.65 54.2,33.62 54.2,34.7 58.1,38.6 58.1,42.1 v56.5,43.7 54.6,45.6 54.6,51.73 53.8,52.53 25.6,52.53 HDR_IOH.8
BANT
  Top 0.61: ANT.2 6.72,48.12 2.98,44.38 RAB.1
CLK_INT  (via drill 0.41)
  Top 0.305: RTC.P$7 31.8,43.93 RINT.2 32.41,38.86 v34.73,36.55 | AT_SAM.41 37.85,32.65 v36.4,34.1
  Bottom 0.305: v36.4,34.1 36.4,35.08 34.92,36.55 v34.73,36.55
CS_FLASH  (via drill 0.41)
  Top 0.305: FLASH.4 61.22,38.14 61.2,38.16 v61.2,37.1 | v56.33,35.7 56.27,35.65 AT_SAM.14
  Bottom 0.305: v61.2,37.1 57.73,37.1 v56.33,35.7
CS_SD  (via drill 0.41)
  Top 0.305: v35.3,33.8 36.95,32.15 AT_SAM.42
  Bottom 0.305: SD.1 32.53,37.47 35.2,34.8 35.2,33.9 v35.3,33.8
CVA  (via drill 0.41)
  Top 0.61: CV1A.1 14.91,35.88 14.64,36.15 UNA.2 14.61,36.9 CR1A.2 14.6,38.41 v14.6,41.38
  Bottom 0.61: v14.6,41.38 14.6,45.17 ANT.3
CVB  (via drill 0.41)
  Top 0.61: CV1B.1 1.64,36.35 UNB.2 1.64,36.4 CR1B.2 1.66,38.08 1.66,40.79 v1.65,40.8
  Bottom 0.61: v1.65,40.8 1.65,44.56 4.19,47.1 ANT.1
GND  (via drill 0.41)  (3 unrouted)
  Top 0.254: AT_SAM.33 41.6,47.02 41.61,47.02 41.14,47.49 v41.14,47.62 | AT_SAM.54 46.15,29.62 v46.17,29.65
  Top 0.305: RTC.P$6 31,44.9 31.4,45.3 35.91,45.3 v36.84,44.37 | AT_SAM.7 54.85,32.15 56.26,30.74 C08.2 | AT_SAM.47 40.12,29.65 39.47,29 v39.47,28.97 | v53.34,44.92 53.32,44.9 51,44.9 48.65,42.55 AT_SAM.22
  Top 0.406: C12.2 44.95,11.15 45.8,10.3 45.8,9.4 45.4,9 VREG.2
  Top 0.61: C5V.2 42.55,11.6 C12.2 | CGB.2 12.95,39.29 RFB.12 | CFA.2 26.07,45.56 24.96,46.67 24.93,46.66 CD1A.2 | RFA.12 26.05,39.72 CGA.2 26.32,39.66 27.49,38.5 28.95,38.5 v29.07,38.62 | C3.2 54.88,44.07 v54.99,44.07
  Bottom 0.813: U$1.P$3 44.9,41.31 41.84,44.37 v36.84,44.37
  other vias: 48.14,5.19 16.45,1.47 15.57,25.95 23.2,22.07 23.46,27.39 28.14,6.27 58.62,30.06 48.84,15.29 40.24,9.29 3.67,30.07 64.04,40.62 63.64,33.42 46.94,49.09 61.34,7.36 66.35,4.93 55.65,11.33 34.22,34.22 34.1,25.95 43.71,50.24 15.6,10.87 20.1,10.87 26.04,46.49 1.54,51.82 18.79,46.74 43.25,19.25 23.47,30.85 36.64,4.19 57.69,24.94 58.64,44.42 36.5,38.2 57.12,34.94 66.64,23.59 54.22,21.31 61.04,42.82 63.04,21.51 54.71,36.42 34.37,30.2 8.37,48.2 32.96,47.92 63.17,14.31 62.54,4.94 48.22,2.89 31.19,14.69 8.6,36.67 2.98,40.8 16.1,40.82 55.59,46.17 27.47,21.75 35.87,18.91 31.53,41.4 18.95,31.05 21.73,37.85 27.54,48.19 37,28.35
  pour Bottom (isolate 0.254, rank 2): 0.2,53.2 64.4,53.2 66,51.6 66,40.3 68.5,37.8 68.6,5 66,2.4 66,0 0.2,0
  pour Top (isolate 0.305): 0.4,53 64.5,53 65.9,51.6 65.9,40.1 68.3,37.7 68.3,5.2 65.8,2.7 65.8,0.8 65.3,0.3 0.8,0.3 0.3,0.8 0.3,52.9 0.5,52.9
I2C_SCL  (via drill 0.41)
  Top 0.305: AT_SAM.44 37.35,31.15 v37.1,30.9 35.1,30.9 34.67,31.32 32.84,31.32 RC.2 | RTC.P$4 31.8,47.58 v31.62,47.75 30.23,49.15 28.43,49.15 27.67,49.9 27.67,51.83 26.97,52.53 23.43,52.53 22.6,51.7 22.6,49.9 22.58,49.9 21.76,49.07 20.52,49.07 HDR_IOH.10 | HDR_IOH.10
  Bottom 0.305: v31.62,47.75 31.8,47.58 31.8,46.9 33.9,44.8 33.9,38.6 34.4,38.1 35.4,38.1 37.8,35.7 37.8,31.6 v37.1,30.9
I2C_SDA  (via drill 0.41)
  Top 0.305: AT_SAM.43 36.65,31.65 36.6,31.7 v36.2,31.7 35.1,31.7 33.9,32.9 RD.2 | RTC.P$5 30.4,47.3 v30.4,47.73
  Bottom 0.305: HDR_IOH.9 21.34,50.46 22.74,49.06 28.99,49.06 v30.4,47.73 30.4,47.3 33.2,44.5 33.2,38.3 34.1,37.4 35.1,37.4 37.2,35.3 37.2,33.6 36.2,32.6 v36.2,31.7
LED
  Top 0.305: 35.46,16.86 37.8,19.2 37.8,22.88 38.23,23.3 42.25,23.3 42.88,23.93 43.67,23.93 44.65,24.9 AT_SAM.51
  Top 0.406: LED1.C 35.46,16.86
N$1
  Top 0.406: LED1.A 37.53,16.51 R1.1
N$2
  Top 0.61: RFB.15 11.85,43.1 12.69,42.26 CFB.1
N$3
  Top 0.61: RFB.11 12.03,38.02 12.49,37.56 CGB.1
N$4
  Top 0.61: CFA.1 25.96,43.52 RFA.15
N$5
  Top 0.61: CGA.1 25.86,38.28 25.86,38.29 25.7,38.45 RFA.11
N$6
  Top 0.61: RFA.16 23.76,44.81 23.35,44.81 23.19,45.15 CD1A.1
N$7
  Top 0.61: RFB.6 3.26,38.02 | 3.26,38.02 3.24,38.02 UNB.1 | 3.26,38.02 CR1B.1
N$8
  Top 0.61: RFB.8 4.71,35.48 CV2B.1 CV1B.2
N$9
  Top 0.61: RFB.16 11.49,44.37 12.51,45.39 CD1B.1
N$10
  Top 0.813: SWITCH.P2A SWITCH.P2B 17.9,4.7 F1.1
N$11
  Top 0.61: CD2B.2 11.04,35.48 RFB.9
N$12
  Top 0.61: UNA.1 16.24,36.9 CR1A.1 16.24,38.45 RFA.6
N$13
  Top 0.61: CV1A.2 CV2A.1 18.01,35.91 RFA.8
N$15
  Top 0.61: CD2B.1 12.66,35.94 11.85,36.75 RFB.10
N$16
  Top 0.61: RFB.3 3.72,41.83 3.17,42.38 RAB.2
N$17
  Top 0.813: Q1.2 10.3,4.54 SWITCH.P1B SWITCH.P1A
N$18
  Top 0.61: RFA.9 24.21,35.91 CD2A.2
N$19
  Top 0.61: RFA.10 25.05,37.17 25.85,36.38 25.85,34.01 CD2A.1
N$20
  Top 0.61: RFA.3 16.08,42.26 RAA.2
N$21
  Top 0.305: RTC.P$9 33.4,43.56 R3.1
N$23  (via drill 0.41)
  Top 0.61: v36.45,43.12 35.51,43.12 R3.2
  Bottom 0.61: v36.45,43.12 36.6,42.98 36.6,40.56 U$1.P$1
N$24
  Top 0.305: C53.1 45.65,24.04 AT_SAM.53
N$25
  Top 0.305: AT_SAM.55 46.65,23.51 C55.1
PIN_D0/RX
  Top 0.305: HDR_IOL.1 61.9,49.2 59.9,49.2 59.3,48.6 57.7,48.6 56.2,47.1 50.5,47.1 47.15,43.75 AT_SAM.25
PIN_D1/TX
  Top 0.305: HDR_IOL.2 60.5,50.8 58.96,49.2 57.4,49.2 55.9,47.7 50.2,47.7 46.65,44.15 AT_SAM.26
PIN_D2
  Top 0.305: HDR_IOL.3 58.12,50.8 55.62,48.3 49.9,48.3 46.15,44.55 AT_SAM.27
PIN_D3
  Top 0.305: HDR_IOL.4 53.98,48.9 49.6,48.9 45.65,44.95 AT_SAM.28
PIN_D4  (via drill 0.41)
  Top 0.305: AT_SAM.23 48.15,42.95 50.7,45.5 52.7,45.5 v53.3,46.1
  Bottom 0.305: HDR_IOL.5 53,50.46 53,47 53.3,46.7 v53.3,46.1
PIN_D5  (via drill 0.41)
  Top 0.305: v52.2,46.3 52,46.1 50.4,46.1 47.65,43.35 AT_SAM.24
  Bottom 0.305: v52.2,46.3 52.2,49.4 HDR_IOL.6
PIN_D6
  Top 0.305: HDR_IOL.7 48.26,48.46 45.15,45.35 AT_SAM.29
PIN_D7
  Top 0.305: HDR_IOL.8 45.72,46.82 44.65,45.75 AT_SAM.30
PIN_D8
  Top 0.305: HDR_IOH.1 44.15,48.31 AT_SAM.31
PIN_D9
  Top 0.305: AT_SAM.32 43.65,48.02 42.45,49.23 40.69,49.23 HDR_IOH.2
PIN_D10/SS  (via drill 0.41)
  Top 0.305: AT_SAM.37 39.7,34.65 38.58,35.77 38.58,46.33 37.3,47.6 v36.9,47.6
  Bottom 0.305: v36.9,47.6 36.9,50.48 HDR_IOH.3
PIN_D11/MOSI
  Top 0.305: HDR_IOH.4 35.84,49 37.5,49 39.65,46.85 39.65,36.33 40.33,35.65 AT_SAM.35
PIN_D12/MISO  (via drill 0.41)
  Top 0.305: AT_SAM.38 39.38,34.15 38.02,35.5 38.02,46.08 37.3,46.8 36.3,46.8 35.8,47.3 v35.8,47.4
  Bottom 0.305: v35.8,47.4 34.9,47.4 HDR_IOH.5
PIN_D13/SCK
  Top 0.305: HDR_IOH.6 29.46,50.8 31.06,49.2 34.6,49.2 35.4,48.4 37.3,48.4 39.12,46.58 39.12,36.02 40,35.15 AT_SAM.36
PIN_D14
  Top 0.305: AT_SAM.59 48.65,25.05 50.7,23 50.7,20.02 50.35,19.68 48.6,19.68 48.08,19.15 46.4,19.15 AUX_IO.6
PIN_D15
  Top 0.305: AUX_IO.5 48.97,19.18 50.69,19.18 51.23,19.71 51.23,23.23 49.15,25.3 AT_SAM.60
RESET  (via drill 0.41)
  Top 0.152: RE.TP 62.5,12.3
  Top 0.305: ICSP10.10 65.53,15.03 64.5,14 64.2,14 62.5,12.3 | AT_SAM.52 45.15,24.47 44.06,23.38 43.08,23.38 42.3,22.6 CRST.1 42.25,22.36 40.65,22.36 R2.1 38.76,22.41 v38.75,22.4
  Bottom 0.305: v38.75,22.4 39,22.15 39,5.3 39.4,4.9 39.4,4.27 | 39.4,4.27 39.4,1.6 38.8,1 34.3,1 33.02,2.28 HDR_POWER.3 | 39.4,4.27 60.74,4.27 63.17,6.7 63.17,9.03 65.36,11.21 65.36,15.29 ICSP10.10
RFID_IN1  (via drill 0.41)
  Top 0.305: AT_SAM.49 43.65,25.65 43.02,25.02 42.27,25.02 41.73,24.48 29.12,24.48 v28.8,24.8
  Top 0.61: v25.5,40.98 v25.49,40.98 RFA.13
  Bottom 0.305: v28.8,24.8 28.73,24.8 27.9,25.62 27.9,37.05 25.77,39.17 25.77,40.7 v25.5,40.98
RFID_IN2  (via drill 0.41)
  Top 0.305: RFB.13 v9.01,40.56 v9,40.55 | AT_SAM.50 44.15,25.27 43.33,24.45 42.6,24.45 42.02,23.88 28.7,23.88 v28.55,23.73
  Bottom 0.305: v9,40.55 11.71,40.55 v28.54,23.73 v28.55,23.73
RFID_STBY1
  Top 0.305: AT_SAM.39 39.05,33.65 37,35.7 34.38,35.7 27.82,42.26 RFA.14
RFID_STBY2  (via drill 0.41)
  Top 0.305: RFB.14 8.99,41.83 v8.97,41.85 | v26.98,36.6 28.48,35.1 36.75,35.1 38.7,33.15 AT_SAM.40
  Bottom 0.305: v26.98,36.6 16.57,36.6 11.82,41.35 9.47,41.35 v8.97,41.85
RST  (via drill 0.41)
  Top 0.406: R4.1 38.8,12.73 38.8,17.6 39.9,18.7 | R2.2 40.6,19.44 40.23,19.03 39.9,18.7 | v39.9,18.65 39.9,18.7
  Top 0.61: R4.1 36.12,11.93 D1.A 32.73,11.68 32.71,11.7 | RESET.3 32.71,11.7 | 32.71,11.7 RESET.4
  Bottom 0.305: ICSP6.5 63.63,25.9 61.63,27.9 52.8,27.9 51.12,26.23 40.38,26.23 39.6,25.45 39.6,18.95 v39.9,18.65
SPI_MISO  (via drill 0.41)
  Top 0.305: AT_SAM.20 49.65,39.8 51.45,41.6 56.3,41.6 57.41,42.71 FLASH.8 57.41,47.41 58,48 61.6,48 62.2,47.4 v62.2,33.4
  Bottom 0.305: SD.7 35.82,22.47 40.17,26.82 50.9,26.82 52.5,28.43 61.6,28.43 63.63,30.45 ICSP6.1 63.63,31.87 62.2,33.3 v62.2,33.4
SPI_MOSI  (via drill 0.41)
  Top 0.305: v66,32.5 66.66,31.84 67.5,31 67.5,29.27 ICSP6.4 | AT_SAM.17 51.15,38.4 57.41,38.4 FLASH.1 57.41,37.54 58.4,36.55 v58.4,36.3
  Bottom 0.305: v66,32.5 65.98,32.5 64.28,34.2 58.4,34.2 v58.4,36.3 58.4,33.27 55.42,30.3 52.8,30.3 50.49,27.99 38.81,27.99 33.4,33.4 33.4,33.95 32.38,34.97 SD.2
SPI_SCK  (via drill 0.41)
  Top 0.305: ICSP6.3 62.3,29.27 62.3,31.41 v62.21,31.5 61.9,31.5 59.6,33.8 59.6,35.3 | FLASH.2 58.68,37.22 59.6,36.3 59.6,35.3 | AT_SAM.18 50.65,37.7 50.85,37.5 55.9,37.5 58.2,35.2 59.5,35.2 59.6,35.3
  Bottom 0.305: v62.21,31.5 62.21,29.88 61.31,28.97 52.24,28.97 50.65,27.37 32.86,27.37 32.76,27.47 SD.5
SW
  Top 0.61: VREG.5 50.05,9.95 L1.P$1
SWCLK  (via drill 0.41)
  Top 0.305: ICSP10.4 66.13,19.27 66.6,18.8 66.6,14.9 64,12.3 CK.TP | AT_SAM.57 47.65,24.19 v48.26,23.57
  Bottom 0.305: ICSP10.4 65.87,19.27 66.5,19.9 66.5,21.4 64.5,23.4 48.42,23.4 v48.26,23.56 v48.26,23.57
SWDIO  (via drill 0.41)
  Top 0.305: AT_SAM.58 48.15,24.75 49.9,23 v49.9,22.52 | ICSP10.2 66.06,20.54 67.2,19.4 67.2,14.5 65.5,12.8 IO.TP
  Bottom 0.305: ICSP10.2 65.53,21.37 64.1,22.8 49.9,22.8 v49.9,22.52
USB_N
  Top 0.305: AT_SAM.45 39.81,30.65 12,23.29 USB.D-
USB_P
  Top 0.305: USB.D+ 11.25,22.52 39.9,30.15 AT_SAM.46
V_IN  (via drill 0.41)
  Top 0.406: VREG.3 44.5,7.9 44.4,7.9 | VREG.1 44.45,9.95 44.3,10.1
  Top 0.61: RFB.7 5.46,36.72 6.89,36.72 | v33.7,19.52 31.73,21.5 CE3.+ | F1.2 v25,3.8 | 6.89,36.72 7.29,37.12 7.29,39.88 6.62,40.56 RFB.4 | 6.89,36.72 6.93,36.72 9.49,34.16 CBLKB.1 9.49,32.66 CE2.+ 12.95,28.75 14.12,27.57 v22.07,27.57 22.07,28.2 CE1.+ 21.11,29.29 CBLKA.1 21.11,36.19 20.12,37.17 | RFA.7 20.12,37.17 | 20.12,37.17 20.51,37.56 20.51,40.37 19.89,40.98 RFA.4
  Top 0.813: 42.6,7.9 v38.2,7.9 | HDR_POWER.8 45.72,2.98 44.1,4.6 39.9,4.6 38.1,2.8 HDR_POWER.5 | 44.4,7.9 42.6,7.9 | 42.6,7.9 42.4,8 C5V.1 42.55,9.9 43.3,9.9 43.5,10.1 44.3,10.1
  Bottom 0.406: HDR_POWER.8 47.36,0.9 64.3,0.9 65.1,1.7 65.1,5.47 63.86,6.71 63.86,8.63 66.02,10.79 66.02,13.86 67.3,15.15 67.3,18.5 67.62,18.82 67.62,29.02 ICSP6.2
  Bottom 0.61: v22.07,27.57 22.15,27.65 22.15,19.85 33.73,8.28 | v33.7,19.52 33.73,19.5 33.73,8.28 | HDR_POWER.5 38.1,5.17 | 38.1,5.17 38.1,7.8 v38.2,7.9 | 33.77,5.17 26.38,5.17 v25,3.8 | 33.77,5.17 38.1,5.17 | 33.77,5.17 33.73,5.22 33.73,8.28
VDDANA  (via drill 0.41)
  Top 0.305: v60.2,20.57 60.4,20.77 60.4,27.6 59.9,28.1 59.9,30.28 57.55,32.64 C08.1 56.98,32.65 AT_SAM.8
  Top 0.61: C12.1 46.55,11.8 51.4,11.8 L6.1 51.8,13.3 53.38,14.88 v57.42,14.88
  Bottom 0.406: v60.2,20.57 60.2,17.65 v57.42,14.88
XIN32
  Top 0.305: AT_SAM.1 53.46,29.15 Y4.P$1 53.46,25.28 C9.2
XOUT32
  Top 0.305: AT_SAM.2 | AT_SAM.2 54.23,29.65 56.56,27.32 Y4.P$2 56.56,25.19 C10.2
XUSB  (via drill 0.41)
  Top 0.508: USB.VBUS 10.62,24.14 v10.79,24.31
  Top 0.813: SWITCH.P3B SWITCH.P3A | C7.1 11.78,25.3 v10.79,24.31
  Bottom 0.813: SWITCH.P3A 22,14.45 12.14,24.31 v10.79,24.31

### Text on the board
tPlace: IOREF / 3.3V | RESET | 3.3V | V IN / 5V | GND | GND | V IN / 5V | ADC / A0 | A1 | A2 | A3 | A4 | A5
tNames: RX0 | SCL | SDA | AREF | GND | 13 | 12 | 11 | 10 | 9 | 8 | 7 | 6 | 5 | 4 | 3 | 2 | TX1 | ANT 2 | ANT 1 | 1 | 1 | 1 | 1 | 1 | RFID Arduino V10.1 / Eli Bridge - Univ of Okla / Jay Wilhelm - Ohio Univ / January 2023 | 1 | <-ON BATTERY | ON USB-> | 40 | 39 | A6 | A7 | A8 | A9 | - | - | - | - | L1 / 2.2uH | - | + | + | + | + | +
tValues: 21J
214bmp: D:/SmartProjects/Snc/a4_bn_logo2.bmp